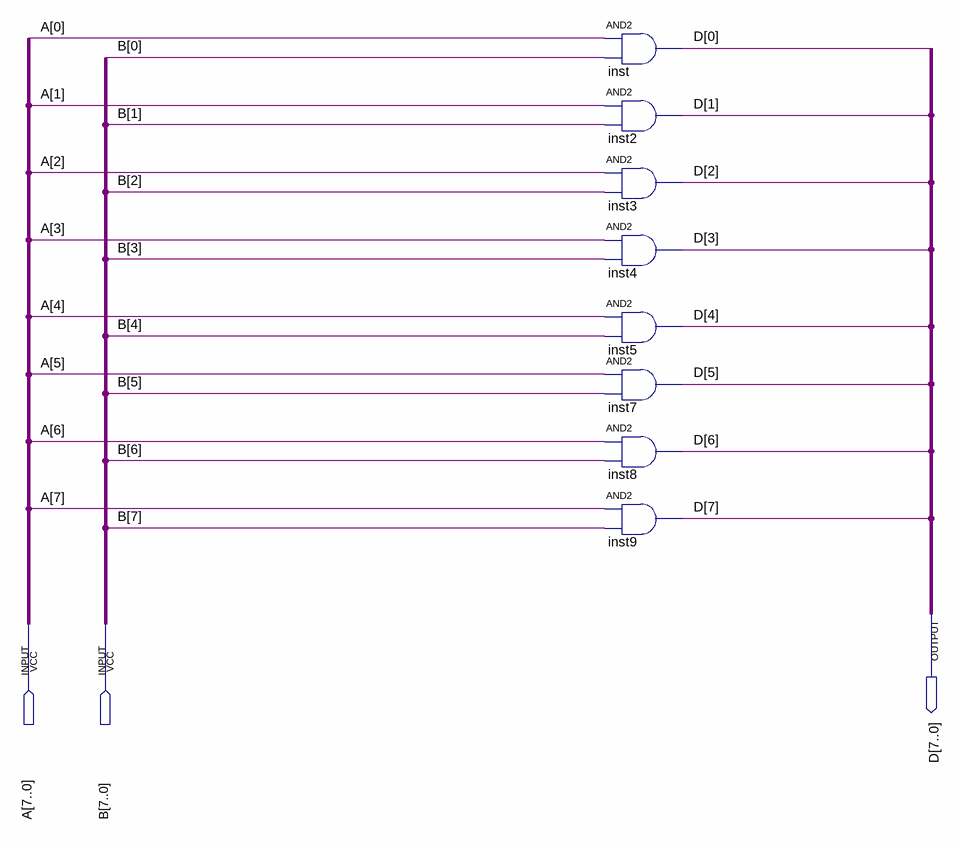
[diagram p0: schematic sheet]
// Quartus schematic bitwiseAND_8b_2w.bdf as structural Verilog: 8 symbols, 3 pins
module bitwiseAND_8b_2w (
  input  [7:0] A,
  input  [7:0] B,
  output [7:0] D
);

  and inst (D[0], A[0], B[0]);
  and inst2 (D[1], A[1], B[1]);
  and inst3 (D[2], A[2], B[2]);
  and inst4 (D[3], A[3], B[3]);
  and inst5 (D[4], A[4], B[4]);
  and inst7 (D[5], A[5], B[5]);
  and inst8 (D[6], A[6], B[6]);
  and inst9 (D[7], A[7], B[7]);
endmodule
